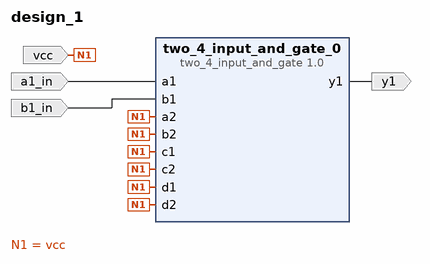
[diagram p0: block diagram of the top level]
# Vivado block design design_1, Vivado 2014.2
create_bd_design design_1

create_bd_port -dir I -type data a1_in
create_bd_port -dir I -type data b1_in
create_bd_port -dir I -type data vcc
create_bd_port -dir O -type data y1

create_bd_cell -type ip -vlnv xilinx.com:XUP:two_4_input_and_gate:1.0 two_4_input_and_gate_0

# ---- connections ----

connect_bd_net [get_bd_ports a1_in] [get_bd_pins two_4_input_and_gate_0/a1]
connect_bd_net [get_bd_ports b1_in] [get_bd_pins two_4_input_and_gate_0/b1]
connect_bd_net [get_bd_ports vcc] \
  [get_bd_pins two_4_input_and_gate_0/c1] [get_bd_pins two_4_input_and_gate_0/d1] [get_bd_pins two_4_input_and_gate_0/a2] \
  [get_bd_pins two_4_input_and_gate_0/b2] [get_bd_pins two_4_input_and_gate_0/c2] [get_bd_pins two_4_input_and_gate_0/d2]
connect_bd_net [get_bd_pins two_4_input_and_gate_0/y1] [get_bd_ports y1]

validate_bd_design
save_bd_design
